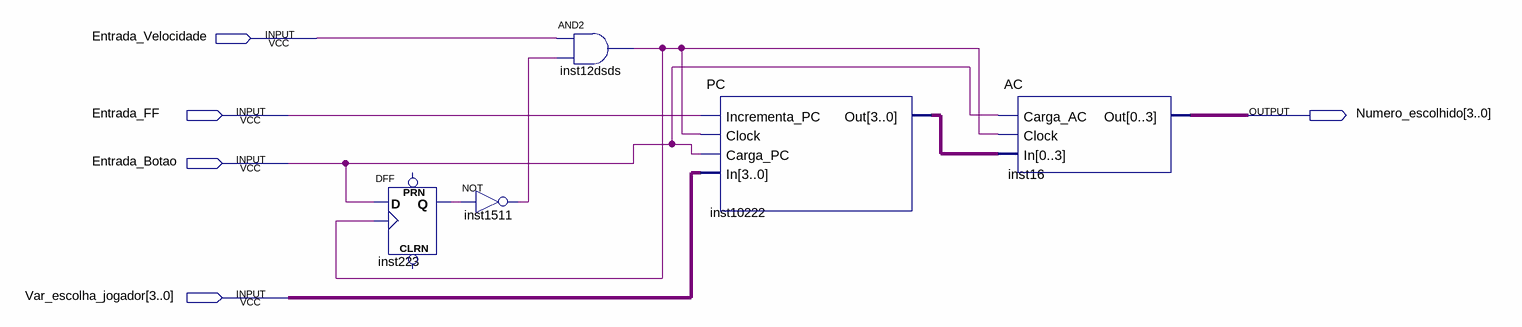
[diagram p0: schematic sheet]
// Quartus schematic Seletor_4bits.bdf as structural Verilog: 5 symbols, 5 pins
module Seletor_4bits (
  input  Entrada_Velocidade,
  input  Entrada_FF,
  input  Entrada_Botao,
  input  [3:0] Var_escolha_jogador,
  output [3:0] Numero_escolhido
);

  wire inst12dsds_out, inst223_q, inst1511_out;
  wire [3:0] inst10222_out;

  DFF inst223 (.CLK(inst12dsds_out), .D(Entrada_Botao), .Q(inst223_q));  // open: CLRN, PRN
  not inst1511 (inst1511_out, inst223_q);
  and inst12dsds (inst12dsds_out, Entrada_Velocidade, inst1511_out);
  PC inst10222 (
    .Incrementa_PC(Entrada_FF), .Clock(inst12dsds_out), .Carga_PC(Entrada_Botao), .In(Var_escolha_jogador),
    .Out(inst10222_out));
  AC inst16 (.Carga_AC(Entrada_Botao), .Clock(inst12dsds_out), .In(inst10222_out), .Out(Numero_escolhido));
endmodule
